# Altium schematic sheet BUCK and LDO_ PWR.SchDoc
size 420 x 297 mm; SheetNumber: 20; SheetTotal: 20
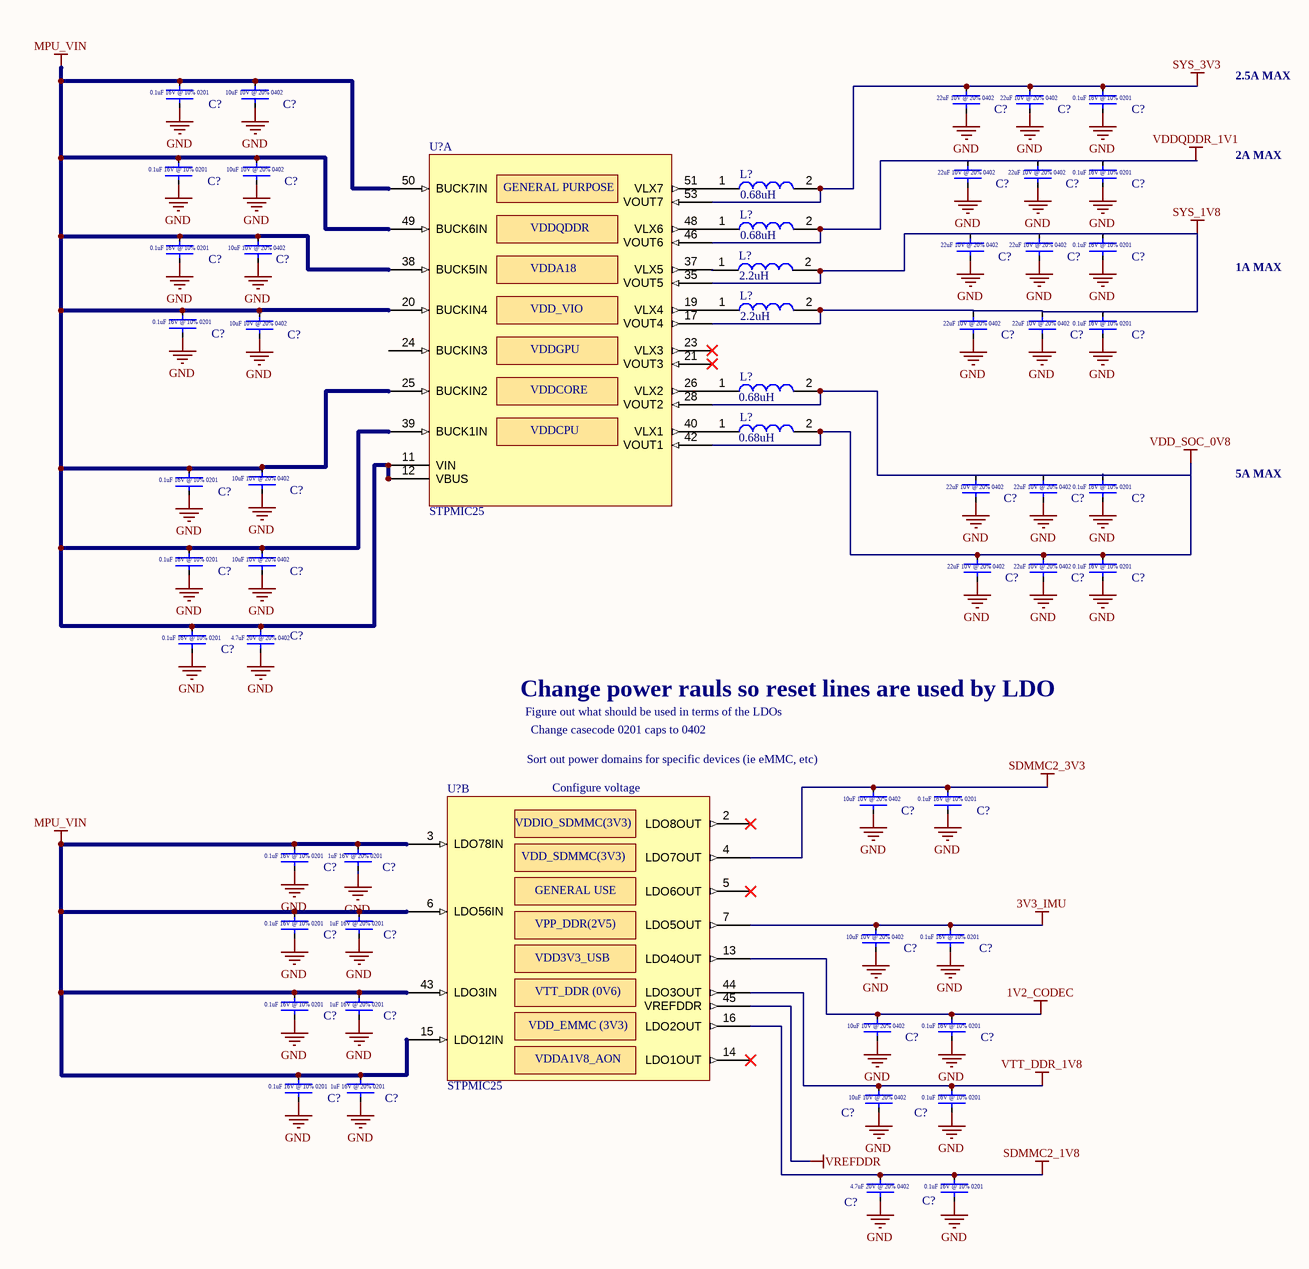
[diagram p0: BUCK and LDO_ PWR.SchDoc]

## Parts
(Parts that share a designator on the sheet are numbered #1, #2 ... from top to bottom, then left to right.)
C?#1  0.1uF  [CAPC0603X03L]  (value not drawn)
C?#2  GRT155R61A106ME13J  [CAPC1005X06L]  (value not drawn)
C?#3  GRM158R61A226ME15D  [CAPC1005X06L]  (value not drawn)
C?#4  GRM158R61A226ME15D  [CAPC1005X06L]  (value not drawn)
C?#5  0.1uF  [CAPC0603X03L]  (value not drawn)
C?#6  0.1uF  [CAPC0603X03L]  (value not drawn)
C?#7  GRT155R61A106ME13J  [CAPC1005X06L]  (value not drawn)
C?#8  GRM158R61A226ME15D  [CAPC1005X06L]  (value not drawn)
C?#9  GRM158R61A226ME15D  [CAPC1005X06L]  (value not drawn)
C?#10  0.1uF  [CAPC0603X03L]  (value not drawn)
C?#11  0.1uF  [CAPC0603X03L]  (value not drawn)
C?#12  GRT155R61A106ME13J  [CAPC1005X06L]  (value not drawn)
C?#13  GRM158R61A226ME15D  [CAPC1005X06L]  (value not drawn)
C?#14  GRM158R61A226ME15D  [CAPC1005X06L]  (value not drawn)
C?#15  0.1uF  [CAPC0603X03L]  (value not drawn)
C?#16  0.1uF  [CAPC0603X03L]  (value not drawn)
C?#17  GRT155R61A106ME13J  [CAPC1005X06L]  (value not drawn)
C?#18  GRM158R61A226ME15D  [CAPC1005X06L]  (value not drawn)
C?#19  GRM158R61A226ME15D  [CAPC1005X06L]  (value not drawn)
C?#20  0.1uF  [CAPC0603X03L]  (value not drawn)
C?#21  0.1uF  [CAPC0603X03L]  (value not drawn)
C?#22  GRT155R61A106ME13J  [CAPC1005X06L]  (value not drawn)
C?#23  GRM158R61A226ME15D  [CAPC1005X06L]  (value not drawn)
C?#24  GRM158R61A226ME15D  [CAPC1005X06L]  (value not drawn)
C?#25  0.1uF  [CAPC0603X03L]  (value not drawn)
C?#26  0.1uF  [CAPC0603X03L]  (value not drawn)
C?#27  GRT155R61A106ME13J  [CAPC1005X06L]  (value not drawn)
C?#28  GRM158R61A226ME15D  [CAPC1005X06L]  (value not drawn)
C?#29  GRM158R61A226ME15D  [CAPC1005X06L]  (value not drawn)
C?#30  0.1uF  [CAPC0603X03L]  (value not drawn)
C?#31  0.1uF  [CAPC0603X03L]  (value not drawn)
C?#32  4.7uF  [CAPC1005X06L]  (value not drawn)
C?#33  GRT155R61A106ME13J  [CAPC1005X06L]  (value not drawn)
C?#34  0.1uF  [CAPC0603X03L]  (value not drawn)
C?#35  0.1uF  [CAPC0603X03L]  (value not drawn)
C?#36  GRM033R61C105ME15D  [CAPC0603X03L]  (value not drawn)
C?#37  0.1uF  [CAPC0603X03L]  (value not drawn)
C?#38  GRM033R61C105ME15D  [CAPC0603X03L]  (value not drawn)
C?#39  GRT155R61A106ME13J  [CAPC1005X06L]  (value not drawn)
C?#40  0.1uF  [CAPC0603X03L]  (value not drawn)
C?#41  0.1uF  [CAPC0603X03L]  (value not drawn)
C?#42  GRM033R61C105ME15D  [CAPC0603X03L]  (value not drawn)
C?#43  GRT155R61A106ME13J  [CAPC1005X06L]  (value not drawn)
C?#44  0.1uF  [CAPC0603X03L]  (value not drawn)
C?#45  0.1uF  [CAPC0603X03L]  (value not drawn)
C?#46  GRM033R61C105ME15D  [CAPC0603X03L]  (value not drawn)
C?#47  GRT155R61A106ME13J  [CAPC1005X06L]  (value not drawn)
C?#48  0.1uF  [CAPC0603X03L]  (value not drawn)
C?#49  4.7uF  [CAPC1005X06L]  (value not drawn)
C?#50  0.1uF  [CAPC0603X03L]  (value not drawn)
L?#1  0.68uH  [1285ASH1R0MP2]
L?#2  0.68uH  [1285ASH1R0MP2]
L?#3  2.2uH  [1285ASH1R0MP2]
L?#4  2.2uH  [1285ASH1R0MP2]
L?#5  0.68uH  [1285ASH1R0MP2]
L?#6  0.68uH  [1285ASH1R0MP2]
U?#1  STPMIC25  [QFN127P600-8N]  (part A of 3)
U?#2  STPMIC25  [QFN127P600-8N]  (part B of 3)

## Nets
1V2_CODEC: C?#43.2 C?#44.2 U?#2.13(LDO4OUT)
3V3_IMU: C?#39.2 C?#40.2 U?#2.7(LDO5OUT)
GND: C?#1.1 C?#2.1 C?#3.1 C?#4.1 C?#5.1 C?#6.1 C?#7.1 C?#8.1 C?#9.1 C?#10.1 C?#11.1 C?#12.1 C?#13.1 C?#14.1 C?#15.1 C?#16.1 C?#17.1 C?#18.1 C?#19.1 C?#20.1 C?#21.1 C?#22.1 C?#23.1 C?#24.1 C?#25.1 C?#26.1 C?#27.1 C?#28.1 C?#29.1 C?#30.1 C?#31.1 C?#32.1 C?#33.1 C?#34.1 C?#35.1 C?#36.1 C?#37.1 C?#38.1 C?#39.1 C?#40.1 C?#41.1 C?#42.1 C?#43.1 C?#44.1 C?#45.1 C?#46.1 C?#47.1 C?#48.1 C?#49.1 C?#50.1
MPU_VIN: C?#1.2 C?#2.2 C?#6.2 C?#7.2 C?#11.2 C?#12.2 C?#16.2 C?#17.2 C?#21.2 C?#22.2 C?#26.2 C?#27.2 C?#31.2 C?#32.2 C?#35.2 C?#36.2 C?#37.2 C?#38.2 C?#41.2 C?#42.2 C?#45.2 C?#46.2 U?#1.11(VIN) U?#1.12(VBUS) U?#1.20(BUCKIN4) U?#1.25(BUCKIN2) U?#1.38(BUCK5IN) U?#1.39(BUCK1IN) U?#1.49(BUCK6IN) U?#1.50(BUCK7IN) U?#2.3(LDO78IN) U?#2.6(LDO56IN) U?#2.15(LDO12IN) U?#2.43(LDO3IN)
SDMMC2_1V8: C?#49.2 C?#50.2 U?#2.16(LDO2OUT)
SDMMC2_3V3: C?#33.2 C?#34.2 U?#2.4(LDO7OUT)
SYS_1V8: C?#13.2 C?#14.2 C?#15.2 C?#18.2 C?#19.2 C?#20.2 L?#3.2 L?#4.2 U?#1.17(VOUT4) U?#1.35(VOUT5)
SYS_3V3: C?#3.2 C?#4.2 C?#5.2 L?#1.2 U?#1.53(VOUT7)
VDD_SOC_0V8: C?#23.2 C?#24.2 C?#25.2 C?#28.2 C?#29.2 C?#30.2 L?#5.2 L?#6.2 U?#1.28(VOUT2) U?#1.42(VOUT1)
VDDQDDR_1V1: C?#8.2 C?#9.2 C?#10.2 L?#2.2 U?#1.46(VOUT6)
VREFDDR: U?#2.45(VREFDDR)
VTT_DDR_1V8: C?#47.2 C?#48.2 U?#2.44(LDO3OUT)
NetL?#1_1: L?#1.1 U?#1.51(VLX7)
NetL?#2_1: L?#2.1 U?#1.48(VLX6)
NetL?#3_1: L?#3.1 U?#1.37(VLX5)
NetL?#4_1: L?#4.1 U?#1.19(VLX4)
NetL?#5_1: L?#5.1 U?#1.26(VLX2)
NetL?#6_1: L?#6.1 U?#1.40(VLX1)

Not connected (* = marked no-connect by the designer): U?#1 21(VOUT3)* 23(VLX3)* 24(BUCKIN3); U?#2 2(LDO8OUT)* 5(LDO6OUT)* 14(LDO1OUT)*

## Notes on the sheet
- 2.5A MAX
- 2A MAX
- 1A MAX
- 5A MAX
- Change power rauls so reset lines are used by LDO
- Figure out what should be used in terms of the LDOs
- Change casecode 0201 caps to 0402
- (near C?#33) Sort out power domains for specific devices (ie eMMC, etc)
- (near U?#2) Configure voltage
- THIS DOCUMENT AND THE DATA DISCLOSED HEREIN OR
- HEREWITH IS THE PROPERTY OF ALTIUM LIMITED AND MAY
- DWG NO:
- REVISION
- REV:
- DESCRIPTION
- DATE
- APPROVED
- BE FREELY DISTRIBUTED IN WHOLE. NO RIGHTS ARE
- RESERVED OR EXPRESS OR IMPLIED WARANTEE GIVEN.
- ENG:
- APPROVALS
- PROJECT
- DSN:
- CHK:
- REFERENCE DOCUMENTS
- PROJECT REVISION:
- TITLE
- DOCUMENT REVISION:
- DESIGN ITEM:
- BOM:
- FAB DWG:
- PCB DWG:
- ASSY DWG:
- SCALE:
- A3
- SIZE
- CAGE CODE
- FILE NAME
- DWG NO.
- SHEET
- OF
- REV
- (in symbol CL05A475MO5NUNC) 4.7uF 20V @ 20% 0402
- (in symbol GRM033R61C105ME15D) 1uF 16V @ 20% 0201
- (in symbol GRM033R61E104KE14J) 0.1uF 16V @ 10% 0201
- (in symbol GRM158R61A226ME15D) 22uF 10V @ 20% 0402
- (in symbol GRT155R61A106ME13J) 10uF 10V @ 20% 0402
- (in symbol STPMIC25, part A) GENERAL PURPOSE; VDDQDDR; VDDA18; VDD_VIO; VDDGPU; VDDCORE; VDDCPU
- (in symbol STPMIC25, part B) VDDIO_SDMMC(3V3); VDD_SDMMC(3V3); GENERAL USE; VPP_DDR(2V5); VDD3V3_USB; VTT_DDR (0V6); VDD_EMMC (3V3); VDDA1V8_AON

## Library data of the parts
C?#1 C?#5 C?#6 C?#10 C?#11 C?#15 C?#16 C?#20 C?#21 C?#25 C?#26 C?#30 C?#31 C?#34 C?#35 C?#37 C?#40 C?#41 C?#44 C?#45 C?#48 C?#50 = GRM033R61E104KE14J: 0.1 µF ±10% 25V Ceramic Capacitor X5R 0201 (0603 Metric)0.1 µF ±10% 25V Ceramic Capacitor X5R 0201 (0603 Metric); ComponentLink1Description: New link; ComponentLink1URL: https://www.digikey.com.au/en/products/detail/murata-electronics/GRM033R61E104KE14J/4904732?s=N4IgTCBcDaIOICUCyAGAzGhA2AjAURxQBYBpAogKRAF0BfIA
C?#2 C?#7 C?#12 C?#17 C?#22 C?#27 C?#33 C?#39 C?#43 C?#47 = GRT155R61A106ME13J: 10 µF ±20% 10V Ceramic Capacitor X5R 0402 (1005 Metric); ComponentLink1Description: New link; ComponentLink1URL: https://www.digikey.com.au/en/products/detail/murata-electronics/GRT155R61A106ME13J/19115510
C?#3 C?#4 C?#8 C?#9 C?#13 C?#14 C?#18 C?#19 C?#23 C?#24 C?#28 C?#29 = GRM158R61A226ME15D: 22uH 0402; ComponentLink1Description: New link; ComponentLink1URL: https://www.digikey.com.au/en/products/detail/murata-electronics/GRM158R61A226ME15D/16033379
C?#32 C?#49 = CL05A475MO5NUNC: 4.7 µF ±20% 16V Ceramic Capacitor X5R 0402 (1005 Metric)
C?#36 C?#38 C?#42 C?#46 = GRM033R61C105ME15D: 1 µF ±20% 16V Ceramic Capacitor X5R 0201 (0603 Metric); ComponentLink1Description: New link; ComponentLink1URL: https://www.digikey.com.au/en/products/detail/murata-electronics/GRM033R61C105ME15D/10326307
L?#1 L?#2 L?#5 L?#6 = DFE201610E-R68M=P2: DFE201610E-R68M=P; Manufacturer_Name: Murata Electronics; Datasheet Link: https://search.murata.co.jp/Ceramy/image/img/P02/J(E)TE243A-0001.pdf; Height: 1mm; Manufacturer_Part_Number: DFE201610E-R68M=P2; Mouser Part Number: 81-DFE201610E-R68MP2; Mouser Price/Stock: https://www.mouser.co.uk/ProductDetail/Murata-Electronics/DFE201610E-R68M%3dP2?qs=AQlKX63v8RudjlTUxbAxDg%3D%3D; Arrow Part Number: DFE201610E-R68M=P2; Arrow Price/Stock: https://www.arrow.com/en/products/dfe201610e-r68mp2/murata-manufacturing?region=nac
L?#3 L?#4 = DFE201610E-2R2M=P2: Inductor; Manufacturer_Name: Murata Electronics; Datasheet Link: https://search.murata.co.jp/Ceramy/image/img/P02/J(E)TE243A-0001.pdf; Height: 1mm; Manufacturer_Part_Number: DFE201610E-2R2M=P2; Mouser Part Number: 81-DFE201610E-2R2MP2; Mouser Price/Stock: https://www.mouser.co.uk/ProductDetail/Murata-Electronics/DFE201610E-2R2M%3dP2?qs=AQlKX63v8Rv49b3hcvXgWQ%3D%3D; Arrow Part Number: DFE201610E-2R2M=P2; Arrow Price/Stock: https://www.arrow.com/en/products/dfe201610e-2r2mp2/murata-manufacturing?utm_currency=USD&region=nac